# EAGLE design schema (EAGLE 9.3.1)
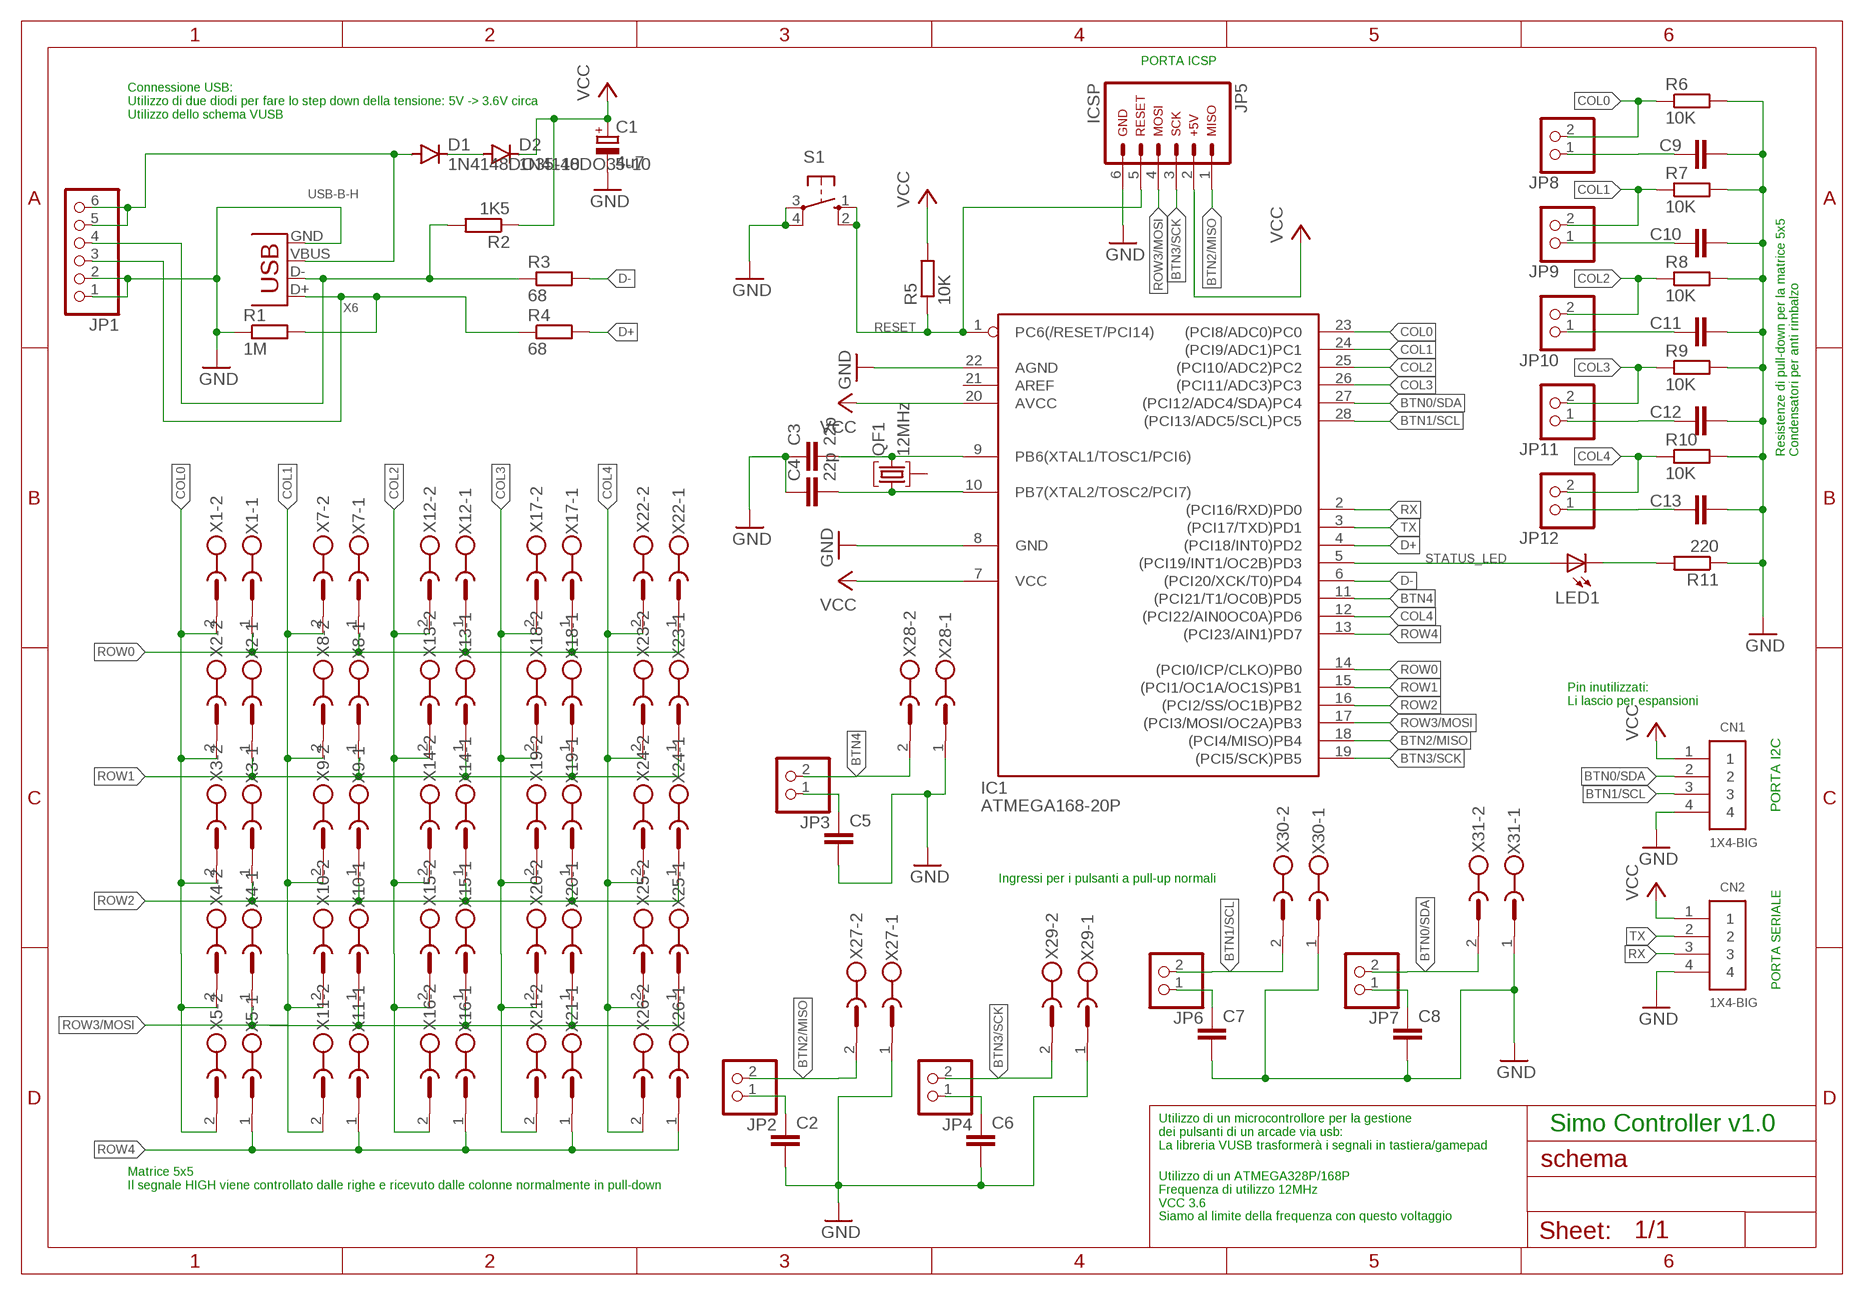
[diagram p0: schematic, sheet 1]

## Parts
C1  4u7  CPOL-EUE5-6  [E5-6]
C2  C-EU050-024X044  [C050-024X044]
C3  22p  C-EU025-030X050  [C025-030X050]
C4  22p  C-EU025-030X050  [C025-030X050]
C5  C-EU050-024X044  [C050-024X044]
C6  C-EU050-024X044  [C050-024X044]
C7  C-EU050-024X044  [C050-024X044]
C8  C-EU050-024X044  [C050-024X044]
C9  C-EU050-024X044  [C050-024X044]
C10  C-EU050-024X044  [C050-024X044]
C11  C-EU050-024X044  [C050-024X044]
C12  C-EU050-024X044  [C050-024X044]
C13  C-EU050-024X044  [C050-024X044]
CN1  1X4-BIG  [1X04-BIG]
CN2  1X4-BIG  [1X04-BIG]
D1  1N4148DO35-10  [DO35-10]
D2  1N4148DO35-10  [DO35-10]
IC1  ATMEGA168-20P  [DIL28-3]
JP1  PINHD-1X6  [1X06]
JP2  PINHD-1X2  [1X02]
JP3  PINHD-1X2  [1X02]
JP4  PINHD-1X2  [1X02]
JP5  ARDUINO_CONN-ICSP  [CONN-2X03]
JP6  PINHD-1X2  [1X02]
JP7  PINHD-1X2  [1X02]
JP8  PINHD-1X2  [1X02]
JP9  PINHD-1X2  [1X02]
JP10  PINHD-1X2  [1X02]
JP11  PINHD-1X2  [1X02]
JP12  PINHD-1X2  [1X02]
LED1  LED3MM  [LED3MM]
QF1  12MHz  10G7A-12.5KHZ  [HC49U]
R1  1M  R-EU_0309/12  [0309/12]
R2  1K5  R-EU_0309/12  [0309/12]
R3  68  R-EU_0309/12  [0309/12]
R4  68  R-EU_0309/12  [0309/12]
R5  10K  R-EU_0309/12  [0309/12]
R6  10K  R-EU_0309/12  [0309/12]
R7  10K  R-EU_0309/12  [0309/12]
R8  10K  R-EU_0309/12  [0309/12]
R9  10K  R-EU_0309/12  [0309/12]
R10  10K  R-EU_0309/12  [0309/12]
R11  220  R-EU_0204/7  [0204/7]
S1  10-XX  [B3F-10XX]
X1  MSTBV2  [MSTBV2]
X2  MSTBV2  [MSTBV2]
X3  MSTBV2  [MSTBV2]
X4  MSTBV2  [MSTBV2]
X5  MSTBV2  [MSTBV2]
X6  USB-B-H  [USB-B-H]
X7  MSTBV2  [MSTBV2]
X8  MSTBV2  [MSTBV2]
X9  MSTBV2  [MSTBV2]
X10  MSTBV2  [MSTBV2]
X11  MSTBV2  [MSTBV2]
X12  MSTBV2  [MSTBV2]
X13  MSTBV2  [MSTBV2]
X14  MSTBV2  [MSTBV2]
X15  MSTBV2  [MSTBV2]
X16  MSTBV2  [MSTBV2]
X17  MSTBV2  [MSTBV2]
X18  MSTBV2  [MSTBV2]
X19  MSTBV2  [MSTBV2]
X20  MSTBV2  [MSTBV2]
X21  MSTBV2  [MSTBV2]
X22  MSTBV2  [MSTBV2]
X23  MSTBV2  [MSTBV2]
X24  MSTBV2  [MSTBV2]
X25  MSTBV2  [MSTBV2]
X26  MSTBV2  [MSTBV2]
X27  MSTBV2  [MSTBV2]
X28  MSTBV2  [MSTBV2]
X29  MSTBV2  [MSTBV2]
X30  MSTBV2  [MSTBV2]
X31  MSTBV2  [MSTBV2]

## Nets
BTN0/SDA: CN1.2 IC1.27((PCI12/ADC4/SDA)PC4) JP7.2 X31.2
BTN1/SCL: CN1.3 IC1.28((PCI13/ADC5/SCL)PC5) JP6.2 X30.2
BTN2/MISO: IC1.18((PCI4/MISO)PB4) JP2.2 JP5.1 X27.2
BTN3/SCK: IC1.19((PCI5/SCK)PB5) JP4.2 JP5.3 X29.2
BTN4: IC1.11((PCI21/T1/OC0B)PD5) JP3.2 X28.2
COL0: IC1.23((PCI8/ADC0)PC0) JP8.2 R6.1 X1.2 X2.2 X3.2 X4.2 X5.2
COL1: IC1.24((PCI9/ADC1)PC1) JP9.2 R7.1 X7.2 X8.2 X9.2 X10.2 X11.2
COL2: IC1.25((PCI10/ADC2)PC2) JP10.2 R8.1 X12.2 X13.2 X14.2 X15.2 X16.2
COL3: IC1.26((PCI11/ADC3)PC3) JP11.2 R9.1 X17.2 X18.2 X19.2 X20.2 X21.2
COL4: IC1.12((PCI22/AIN0OC0A)PD6) JP12.2 R10.1 X22.2 X23.2 X24.2 X25.2 X26.2
D+: IC1.4((PCI18/INT0)PD2) R4.2
D-: IC1.6((PCI20/XCK/T0)PD4) R3.2
GND [power]: C1.- C2.2 C3.1 C4.1 C5.2 C6.2 C7.2 C8.2 C9.2 C10.2 C11.2 C12.2 C13.2 CN1.4 CN2.4 IC1.8(GND) IC1.22(AGND) JP1.1 JP1.2 JP5.6 R1.1 R6.2 R7.2 R8.2 R9.2 R10.2 R11.1 S1.3(P) S1.4(P1) X6.GND X27.1 X28.1 X29.1 X30.1 X31.1
N$1: D1.A JP1.5 JP1.6 X6.VBUS
N$2: D1.C D2.A
N$3: JP1.3 R1.2 R4.1 X6.D+
N$4: JP1.4 R2.2 R3.1 X6.D-
N$5: C3.2 IC1.9(PB6(XTAL1/TOSC1/PCI6)) QF1.3
N$6: C4.2 IC1.10(PB7(XTAL2/TOSC2/PCI7)) QF1.1
N$7: C5.1 JP3.1
N$8: C9.1 JP8.1
N$9: C10.1 JP9.1
N$10: C2.1 JP2.1
N$11: C6.1 JP4.1
N$12: C7.1 JP6.1
N$13: C8.1 JP7.1
N$14: C11.1 JP10.1
N$15: C12.1 JP11.1
N$16: C13.1 JP12.1
N$21: LED1.K(C) R11.2
RESET: IC1.1(PC6(/RESET/PCI14)) JP5.5 R5.1 S1.1(S) S1.2(S1)
ROW0: IC1.14((PCI0/ICP/CLKO)PB0) X1.1 X7.1 X12.1 X17.1 X22.1
ROW1: IC1.15((PCI1/OC1A/OC1S)PB1) X2.1 X8.1 X13.1 X18.1 X23.1
ROW2: IC1.16((PCI2/SS/OC1B)PB2) X3.1 X9.1 X14.1 X19.1 X24.1
ROW3/MOSI: IC1.17((PCI3/MOSI/OC2A)PB3) JP5.4 X4.1 X10.1 X15.1 X20.1 X25.1
ROW4: IC1.13((PCI23/AIN1)PD7) X5.1 X11.1 X16.1 X21.1 X26.1
RX: CN2.3 IC1.2((PCI16/RXD)PD0)
STATUS_LED: IC1.5((PCI19/INT1/OC2B)PD3) LED1.A
TX: CN2.2 IC1.3((PCI17/TXD)PD1)
VCC [power]: C1.+ CN1.1 CN2.1 D2.C IC1.7(VCC) IC1.20(AVCC) JP5.2 R2.1 R5.2
Unconnected: IC1.21(AREF) QF1.2

## Notes on the sheet
- PORTA ICSP
- Connessione USB:
  Utilizzo di due diodi per fare lo step down della tensione: 5V -> 3.6V circa
  Utilizzo dello schema VUSB
- Resistenze di pull-down per la matrice 5x5
  Condensatori per anti rimbalzo
- Pin inutilizzati:
  Li lascio per espansioni
- PORTA I2C
- Ingressi per i pulsanti a pull-up normali
- PORTA SERIALE
- Simo Controller v1.0
- Utilizzo di un microcontrollore per la gestione
  dei pulsanti di un arcade via usb:
  La libreria VUSB trasformerà i segnali in tastiera/gamepad
- Matrice 5x5
  Il segnale HIGH viene controllato dalle righe e ricevuto dalle colonne normalmente in pull-down
- Utilizzo di un ATMEGA328P/168P
  Frequenza di utilizzo 12MHz
  VCC 3.6
  Siamo al limite della frequenza con questo voltaggio

## Library data of the parts
C1 = rcl:CPOL-EU: POLARIZED CAPACITOR, European symbol; SPICEPREFIX: C
C2-C13 = rcl:C-EU: CAPACITOR, European symbol; SPICEPREFIX: C
CN1 CN2 = adafruit:1X4: 4-pin connector
D1 D2 = diode:1N4148: DIODE high speed (Philips)
IC1 = adafruit:ATMEGA168*P: MICROCONTROLLER 16 kBytes FLASH 1 kBytes SRAM 512 Bytes EEPROM USART 8-channel 10 bit ADC
JP1 = pinhead:PINHD-1X6: PIN HEADER
JP2-JP4 JP6-JP12 = pinhead:PINHD-1X2: PIN HEADER
JP5 = arduino_jw:ARDUINO_CONN-ICSP: Arduino ICSP I/O Header This is the ICSP I/O header on the Arduino Uno R3. This connector is labeled with the following pin assignments: MISO +5V SCK MOSI RESET GND NOTE: Be sure you install this connector with the correct orientation on your PCB layout. Pin 1 has a square pad to assist with orientation.
LED1 = adafruit:LED: LED OSRAM: - CHIPLED LG R971, LG N971, LY N971, LG Q971, LY Q971, LO R971, LY R971 LH N974, LH R974 LS Q976, LO Q976, LY Q976 LO Q996 - Hyper CHIPLED LW Q18S LB Q993, LB Q99A, LB R99A - SideLED LS A670, LO A670, LY A670, LG A670, LP A670 LB A673, LV A673, LT A673, LW A673 LH A674 LY A675 LS A676, LA A676, LO A676, LY A676, LW A676 LS A679, LY A679, LG A679 - Hyper Micro SIDELED® LS Y876, LA Y876, LO Y876, LY Y876 LT Y87S - SmartLED LW L88C, LW L88S LB L89C, LB L89S, LG L890 LS L89K, LO L89K, LY L89K LS L896, LA L896, LO L896, LY L896 - TOPLED LS T670, LO T670, LY T670, LG T670, LP T670 LSG T670, LSP T670, LSY T670, LOP T670, LYG T670 LG T671, LOG T671, LSG T671 LB T673, LV T673, LT T673, LW T673 LH T674 LS T676, LA T676, LO T676, LY T676, LB T676, LH T676, LSB T676, LW T676 LB T67C, LV T67C, LT T67C, LS T67K, LO T67K, LY T67K, LW E67C LS E67B, LA E67B, LO E67B, LY E67B, LB E67C, LV E67C, LT E67C LW T67C LS T679, LY T679, LG T679 LS T770, LO T770, LY T770, LG T770, LP T770 LB T773, LV T773, LT T773, LW T773 LH T774 LS E675, LA E675, LY E675, LS T675 LS T776, LA T776, LO T776, LY T776, LB T776 LHGB T686 LT T68C, LB T68C - Hyper Mini TOPLED® LB M676 - Mini TOPLED Santana® LG M470 LS M47K, LO M47K, LY M47K Source: http://www.osram.convergy.de/
QF1 = crystal:10G: Monolithic Crystal Filters Source: www.golledge.com; OC_FARNELL: unknown; OC_NEWARK: unknown
R1-R11 = rcl:R-EU_: RESISTOR, European symbol; SPICEPREFIX: R
S1 = switch-omron:10-XX: OMRON SWITCH; MPN: B3F-1000; OC_FARNELL: 176432; OC_NEWARK: 36M3542
X1-X5 X7-X31 = con-phoenix-500:MSTBV2: PHOENIX; OC_FARNELL: unknown; OC_NEWARK: unknown
X6 = con-usb:USB: USB Connectors

## Net classes
0 default: width 0.4 mm
1 power: width 0.8 mm

## Board
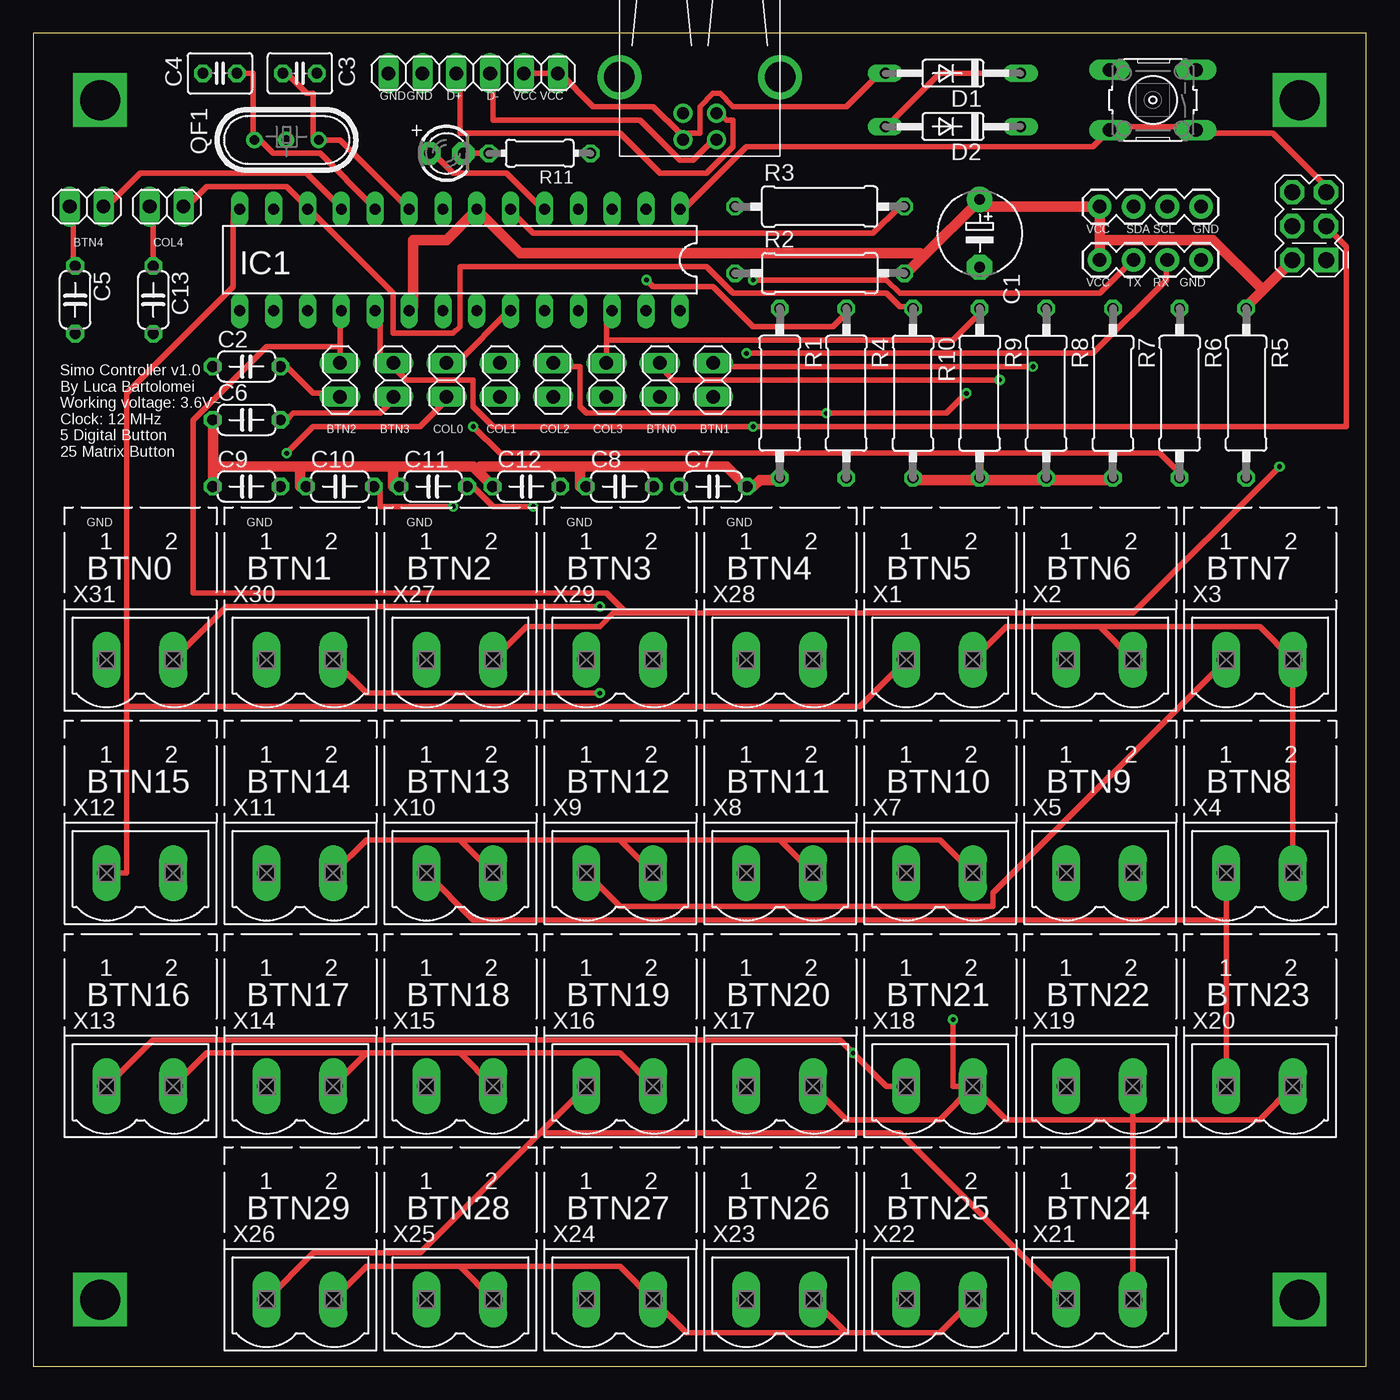
[diagram p1: board, top side]
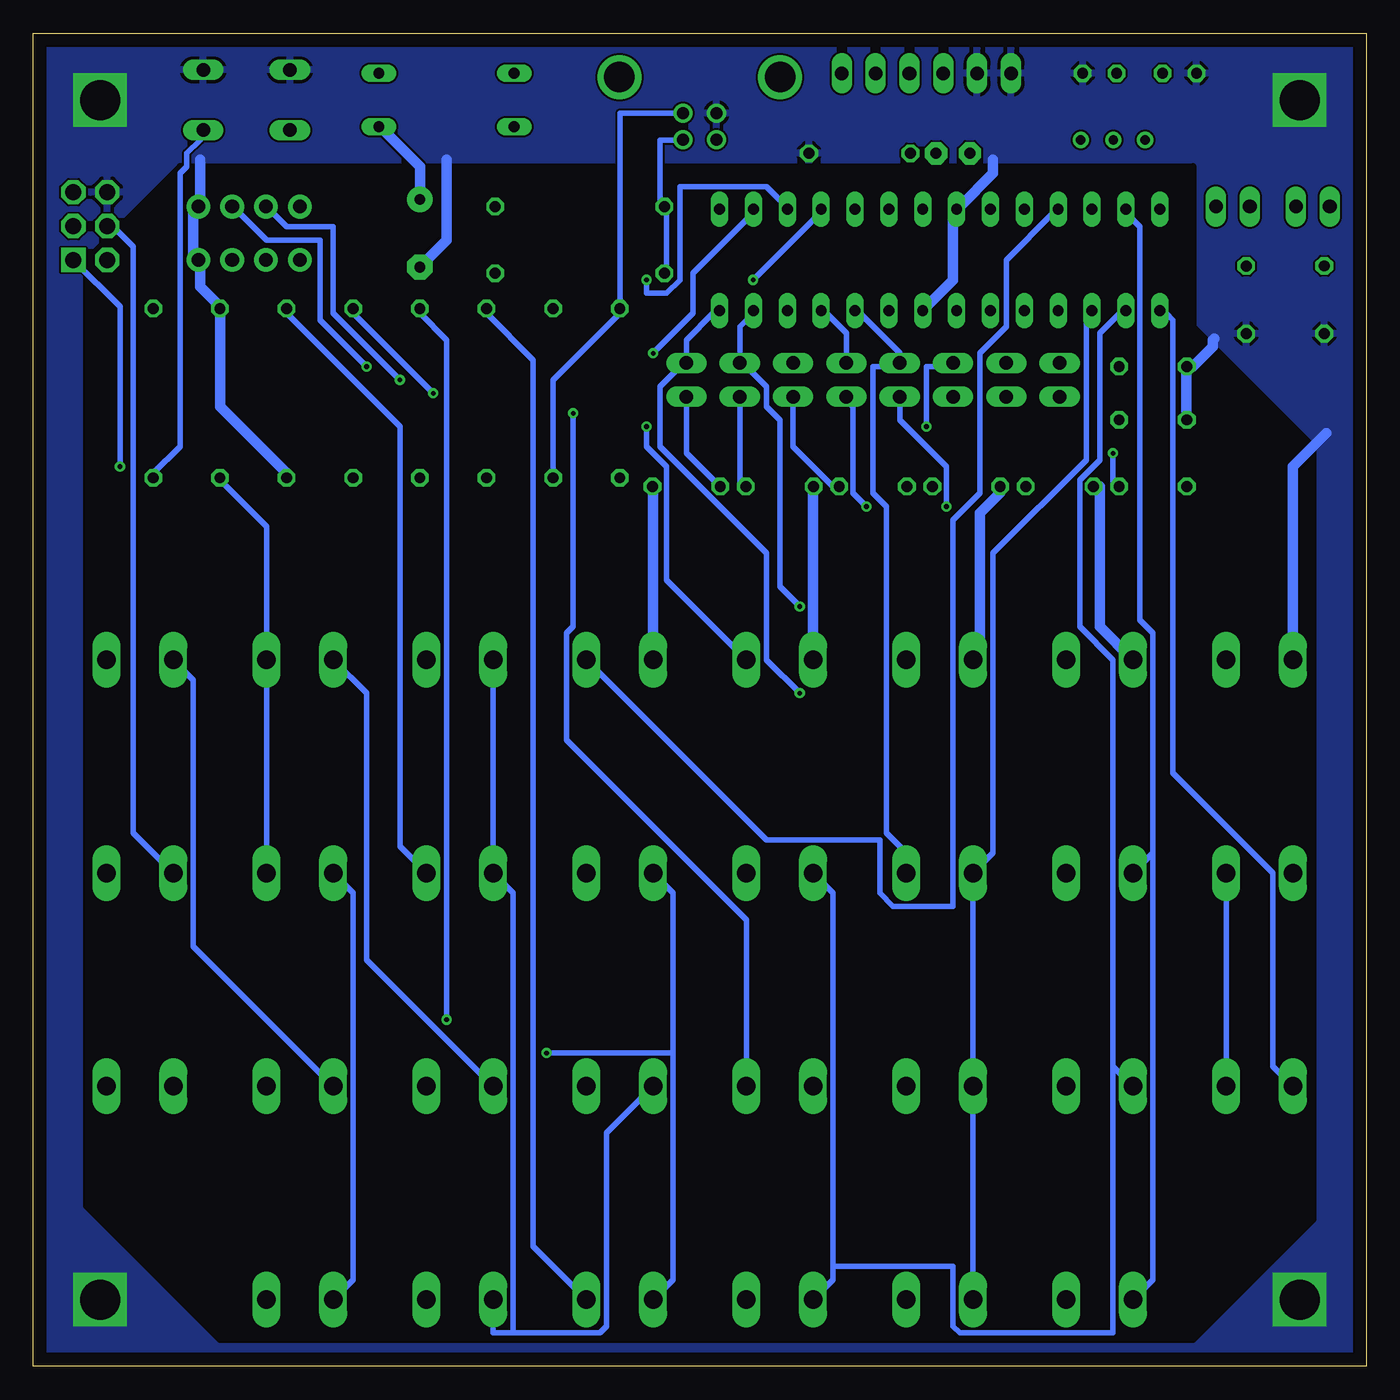
[diagram p2: board, bottom side, seen from below]

Size 100 x 100 mm. Coordinates in mm from the lower left corner, seen from the top.
Outline: 0,0 100,0 100,100 0,100 0,0
Copper layers (1*16): Top 0.035mm / dielectric 1.5mm / Bottom 0.035mm
Design rules "default": minimum track width 6mil, minimum drill 0.35mm, track to track 6mil, track to pad 6mil, pad to pad 6mil, via to via 6mil, smd to smd 6mil, copper to edge 40mil, drill to drill 6mil, minimum pad ring 10mil, minimum via ring 8mil, stop-mask expansion 4mil, vias tented up to drill 0mil, thermal gap 10mil

### Footprints (pad centres in the part's own frame; a part is rotated, then mirrored left to right if it is on the bottom)
E5-6 = drill 0.813 pad 1.905: + -2.54,0 | drill 0.813 pad 1.905 octagon: - 2.54,0
C050-024X044 = drill 0.813 octagon: 1 -2.54,0; 2 2.54,0
C025-030X050 = drill 0.813 octagon: 1 -1.27,0; 2 1.27,0
1X04-BIG = drill 1.016 pad 1.778: 1 0,0; 2 2.54,0; 3 5.08,0; 4 7.62,0
DO35-10 = drill 0.813 long: A 5.08,0; C -5.08,0
DIL28-3 = drill 0.813 long: 1 -16.51,-3.81; 2 -13.97,-3.81; 3 -11.43,-3.81; 4 -8.89,-3.81; 5 -6.35,-3.81; 6 -3.81,-3.81; 7 -1.27,-3.81; 8 1.27,-3.81; 9 3.81,-3.81; 10 6.35,-3.81; 11 8.89,-3.81; 12 11.43,-3.81; 13 13.97,-3.81; 14 16.51,-3.81; 15 16.51,3.81; 16 13.97,3.81; 17 11.43,3.81; 18 8.89,3.81; 19 6.35,3.81; 20 3.81,3.81; 21 1.27,3.81; 22 -1.27,3.81; 23 -3.81,3.81; 24 -6.35,3.81; 25 -8.89,3.81; 26 -11.43,3.81; 27 -13.97,3.81; 28 -16.51,3.81
1X06 = drill 1.016 long: 1 -6.35,0; 2 -3.81,0; 3 -1.27,0; 4 1.27,0; 5 3.81,0; 6 6.35,0
1X02 = drill 1.016 long: 1 -1.27,0; 2 1.27,0
CONN-2X03 = drill 1.2 pad 1.829 square: 1 0,0 | drill 1.2 pad 1.829 octagon: 2 2.54,0; 3 0,-2.54; 4 2.54,-2.54; 5 0,-5.08; 6 2.54,-5.08
LED3MM = drill 0.813 pad 1.676 octagon: A -1.27,0; K 1.27,0
HC49U = drill 0.7 pad 1.2: 1 -2.413,0; 2 -0.027,0; 3 2.413,0
0309/12 = drill 0.813 octagon: 1 -6.35,0; 2 6.35,0
0204/7 = drill 0.813 octagon: 1 -3.81,0; 2 3.81,0
B3F-10XX = drill 1.016 long: 1 -3.251,2.261; 2 3.251,2.261; 3 -3.251,-2.261; 4 3.251,-2.261
MSTBV2 = drill 1.397 long: 1 -2.5,0; 2 2.5,0
USB-B-H = drill 0.914: D+ 0,1.25; D- 1.981,1.25; GND 0,-1.25; VBUS 1.981,-1.25 | drill 2.286: P$1 -2.718,-6.02; P$2 -2.718,6.02

### Placement (x,y rotation side)
C1  71,85 270 top
C2  16,75 180 top
C3  20,97 180 top
C4  14,97 0 top
C5  3.14,80.01 270 top
C6  16,71 180 top
C7  51,66 0 top
C8  44,66 180 top
C9  16,66 180 top
C10  23,66 180 top
C11  30,66 180 top
C12  37,66 180 top
C13  9,80 270 top
CN1  80,87 0 top
CN2  80,83 0 top
D1  69,97 180 top
D2  69,93 180 top
IC1  32,83 180 top
JP1  33,97 0 top
JP2  23,74 90 top
JP3  4,87 0 top
JP4  27,74 90 top
JP5  97,83 180 top
JP6  51,74 90 top
JP7  47,74 90 top
JP8  31,74 90 top
JP9  35,74 90 top
JP10  39,74 90 top
JP11  43,74 90 top
JP12  10,87 0 top
LED1  31,91 0 top
QF1  19,92 0 top
R1  56,73 90 top
R2  59,82 180 top
R3  59,87 0 top
R4  61,73 90 top
R5  91,73 90 top
R6  86,73 90 top
R7  81,73 270 top
R8  76,73 270 top
R9  71,73 270 top
R10  66,73 270 top
R11  38,91 180 top
S1  84,95 180 top
X1  68,53 0 top
X2  80,53 0 top
X3  92,53 0 top
X4  92,37 0 top
X5  80,37 0 top
X6  50,94 270 top
X7  68,37 0 top
X8  56,37 0 top
X9  44,37 0 top
X10  32,37 0 top
X11  20,37 0 top
X12  8,37 0 top
X13  8,21 0 top
X14  20,21 0 top
X15  32,21 0 top
X16  44,21 0 top
X17  56,21 0 top
X18  68,21 0 top
X19  80,21 0 top
X20  92,21 0 top
X21  80,5 0 top
X22  68,5 0 top
X23  56,5 0 top
X24  44,5 0 top
X25  32,5 0 top
X26  20,5 0 top
X27  32,53 0 top
X28  56,53 0 top
X29  44,53 0 top
X30  20,53 0 top
X31  8,53 0 top

### Tracks (layer width: path | path; a pad name or v marks a point on that pad's centre or on a via)
BTN0/SDA  (via drill 0.35)
  Top 0.4: v72.5,74 48,74 47,75 JP7.2 | X31.2 14.5,57 v42.5,57
  Bottom 0.4: 47,75.5 47,78 46,79 IC1.27 | 47,75.5 JP7.2 47,75.5 | v72.5,74 77.5,79 77.5,85.5 81,85.5 82.5,87 CN1.2 | v42.5,57 44,58.5 44,71 45,72 45,73.5 47,75.5
BTN1/SCL  (via drill 0.35)
  Top 0.4: v75,75 51,75 JP6.2 | X30.2 25,50.5 v42.5,50.5
  Bottom 0.4: 51,75.5 51,77 49,79 IC1.28 | 51,75.5 JP6.2 51,75.5 | v75,75 78.5,78.5 78.5,84.5 82.5,84.5 85,87 CN1.3 | v42.5,50.5 45,53 45,61 53,69 53,73.5 51,75.5
BTN2/MISO  (via drill 0.35)
  Top 0.4: 23,76.5 23,75.5 JP2.2 | 23,76.5 23,79 IC1.18 | v93.5,67.5 82.5,56.5 44.5,56.5 | 44.5,56.5 43.5,56.5 42.5,55.5 37,55.5 X27.2 | 23,76.5 17.5,76.5 12,71 12,58 43,58 44.5,56.5
  Bottom 0.4: JP5.1 93.5,79.5 v93.5,67.5
BTN3/SCK  (via drill 0.35)
  Top 0.4: IC1.19 26,79 26,75.5 27,75.5 JP4.2 27,75 28,74 33,74 33,72 34.5,70.5 v54,70.5 98.5,70.5 98.5,84 97,85.5 JP5.3
  Bottom 0.4: X29.2 52.5,59 52.5,67.5 54,69 v54,70.5
BTN4
  Top 0.4: IC1.11 23,87 20.5,89.5 8,89.5 5.5,87 JP3.2
  Bottom 0.4: X28.2 45,39.5 36.5,39.5 36.5,35.5 35.5,34.5 31,34.5 31,63.5 29,65.5 29,76 27,78 27,83 23.5,86.5 IC1.11
COL0  (via drill 0.35)
  Top 0.4: X4.2 X3.2 92,55.5 80,55.5 | IC1.23 35.5,79 32,75.5 31,75.5 JP8.2 | X1.2 73,55.5 80,55.5 | X2.2 80,55.5 | v33,70.5 35,68.5 84.5,68.5 86,67 R6.1
  Bottom 0.4: R6.1 86,66.5 82.5,63 X2.2 X5.2 | v33,70.5 33,75 31,75 JP8.2
COL1
  Top 0.4: X11.2 25,39.5 32,39.5 | X10.2 32,39.5 | 44,39.5 X9.2 | 32,39.5 44,39.5 | 56,39.5 X8.2 | 44,39.5 56,39.5 | X7.2 68,39.5 56,39.5
  Bottom 0.4: X7.2 72.5,39 72.5,70.5 81,79 R7.1 | IC1.24 38,79 35,76 35,75.5 JP9.2 35,75 37,75 37,65.5 36,64.5 36,40 34.5,38.5 X10.2
COL2  (via drill 0.35)
  Top 0.4: v70,73 68.5,71.5 v59.5,71.5 41.5,71.5 41,72 41,75 39,75 JP10.2 | 25,23.5 X14.2 | 32,23.5 25,23.5 | X15.2 32,23.5 | X16.2 44,23.5 32,23.5 | X13.2 13,23.5 25,23.5
  Bottom 0.4: IC1.25 40.5,79 39,77.5 39,75.5 JP10.2 | v70,73 76,79 R8.1 | X12.2 X13.2 | v59.5,71.5 59.5,55.5 60,55 60,47 46.5,33.5 X16.2
COL3  (via drill 0.35)
  Top 0.4: 43,77 43,75.5 JP11.2 | 43,77 43,79 IC1.26 | 43,77 69,77 71,79 R9.1 | X17.2 61,18.5 68,18.5 X18.2 | X19.2 82.5,18.5 | 82.5,18.5 X21.2 | X20.2 92,18.5 82.5,18.5 | X18.2 73,18.5 82.5,18.5 | v69,26 69,21 X18.2
  Bottom 0.4: v69,26 69,77 71,79 R9.1
COL4
  Top 0.4: X26.2 25,7.5 32,7.5 | X25.2 32,7.5 | 32,7.5 44,7.5 X24.2 49,2.5 61,2.5 | JP12.2 11.5,87 13,88.5 19,88.5 20.5,87 IC1.12 21,86.5 27,80.5 27,77.5 31.5,77.5 32,78 32,82.5 50.5,82.5 52.5,80.5 64,80.5 65,79.5 66,79.5 R10.1 | X22.2 68,2.5 61,2.5 | X23.2 61,2.5
  Bottom 0.4: X23.2 62.5,9 62.5,75.5 66,79 R10.1
D+  (via drill 0.35)
  Top 0.4: v46,81.5 46.5,81 51,81 54,78 60,78 61,79 R4.2
  Bottom 0.4: v46,81.5 41,86.5 IC1.4
D-
  Top 0.4: IC1.6 36,86.5 37.5,85 63,85 65,87 R3.2
GND  (via drill 3)
  Top 0.8: R1.1 56,66.5 54.5,66.5 54,66 C7.2 53.5,66 52,67.5 41,67.5 | 13.5,67.5 13.5,71 C6.2 | 13.5,67.5 13.5,66 C9.2 | 20,67.5 20,66 C10.2 | 13.5,67.5 20,67.5 | 27,67.5 27,66 C11.2 | 20,67.5 27,67.5 | 33.25,67.25 33,67.5 27,67.5 | 33.25,67.25 34.5,66 C12.2 | 41,67.5 41,66 C8.2 | 41,67.5 33.5,67.5 33.25,67.25 | 71,66.5 66,66.5 R10.2 | 71,66.5 R9.2 71,66.5 | 71,66.5 76,66.5 | 76,66.5 R8.2 76,66.5 | 76,66.5 81,66.5 R7.2
  Bottom 0.8: X28.1 53.5,66 C7.2 | X30.1 20,55.5 20,66 C10.2 | X27.1 29,53.5 29,64 27.5,65.5 27.5,66 C11.2 | X29.1 41.5,66 C8.2 | 11.39,77.11 11.5,77 11.5,76.5 13,75 C2.2 13.5,75 13.5,71 C6.2 | 28,90.51 28,90.5 28,89.5 30.5,87 IC1.8 31,86.5 31,81.5 33,79.5 IC1.22 | 87.5,90.51 87.5,90.5 87.5,87 CN1.4 88,87 88,83 CN2.4 87.5,83 87.5,81 86,79.5 R6.2 86,79 86,72 81,67 R7.2 | C1.- 71,82.5 69,84.5 69,90.5 69,90.51 | X31.1 5.5,67.5 3,70
  other vias: 5,95 95,95 5,5 95,5
  pour Bottom: 0,100 100,100 100,0 0,0
  cutout Bottom: 13,90 13,78 4,69 4,11 13,2 86,2 96,12 96,83 89,90
N$1
  Top 0.4: JP1.5 37,97 39,97 JP1.6 39.5,97 42,94.5 46.5,94.5 48.5,92.5 X6.VBUS 49,92.5 50,92.5 50,94.5 51,95.5 51.5,95.5 52.5,94.5 61,94.5 63.5,97 D1.A
N$2
  Top 0.4: D2.A 64,93 68,97 74,97 D1.C
N$3
  Top 0.4: JP1.3 32,97 32,92.5 44,92.5 47,89.5 50.5,89.5 52.5,91.5 52.5,93.5 52,93.5 51.5,94 X6.D+
  Bottom 0.4: R4.1 61,67 61,74 56,79 R1.2 56,79.5 56,94 51.5,94 X6.D+
N$4
  Top 0.4: JP1.4 34.5,97 34.5,93.5 45.5,93.5 48.5,90.5 49.5,90.5 51,92 X6.D-
  Bottom 0.4: R2.2 52.5,82 52.5,87 R3.1 53,87 53,92 51.5,92 X6.D-
N$5
  Top 0.4: C3.2 19,97 20.5,95.5 21,95.5 21,92 QF1.3 21.5,92 23,92 28,87 IC1.9
N$6
  Top 0.4: C4.2 15.5,97 16.5,97 16.5,92 QF1.1 17,92 18,91 21.5,91 25.5,87 IC1.10
N$7
  Top 0.4: C5.1 3,83 3,87 JP3.1
N$8  (via drill 0.35)
  Top 0.4: v19,68.5 21,70.5 29,70.5 31,72.5 JP8.1
  Bottom 0.4: v19,68.5 19,66 C9.1
N$9  (via drill 0.35)
  Top 0.4: v31.5,64.5 26,64.5 26,66 C10.1
  Bottom 0.4: v31.5,64.5 31.5,67.5 35,71 35,72.5 JP9.1
N$10
  Top 0.4: C2.1 19,75 21,73 23,73 JP2.1
N$11
  Top 0.4: C6.1 19,71 19.5,71.5 26,71.5 27,72.5 JP4.1
N$12
  Bottom 0.4: C7.1 48.5,66 51,68.5 51,72.5 JP6.1
N$13
  Bottom 0.4: C8.1 47,66 47,72.5 JP7.1
N$14  (via drill 0.35)
  Top 0.4: v37.5,64.5 34.5,64.5 33,66 C11.1
  Bottom 0.4: v37.5,64.5 38.5,65.5 38.5,72 39,72.5 JP10.1
N$15
  Bottom 0.4: C12.1 40,66 43,69 43,72.5 JP11.1
N$16
  Top 0.4: C13.1 9,83 9,87 JP12.1
N$21
  Top 0.4: R11.2 34,91 32.5,91 LED1.K
RESET
  Top 0.4: JP5.5 97,88.5 93,92.5 87.5,92.5 S1.1 87,93 81,93 S1.2 80.5,92.5 79.5,91.5 53.5,91.5 49,87 IC1.1
  Bottom 0.4: R5.1 91,67 89,69 89,89.5 88.5,90 88.5,91 87.5,92 87.5,92.5 S1.1
ROW0
  Top 0.4: 7,49.5 7,37 X12.1 | 7,49.5 7,67 | 7,67 7,73 15,81 15,86.5 IC1.14 | 7,49.5 62,49.5 X1.1 | 7,67
  Bottom 0.4: X1.1 X7.1 64,35.5 64,2.5 | X17.1 57,17.5 57,3 57.5,2.5 64,2.5 | 64,2.5 65.5,2.5 X22.1
ROW1  (via drill 0.35)
  Top 0.4: X18.1 64,21 v61.5,23.5 60.5,24.5 9,24.5 X13.1
  Bottom 0.4: X13.1 7,22.5 7,37 14.5,44.5 14.5,78.5 15,79 IC1.15 | X23.1 52,6.5 52,23.5 | 52,23.5 52,35.5 X8.1 | X18.1 75,30.5 75,50.5 X2.1 | v61.5,23.5 52,23.5
ROW2
  Top 0.4: X3.1 72,35.5 72,34.5 44,34.5 X9.1
  Bottom 0.4: X19.1 88,31.5 88,51.5 X3.1 | X24.1 40,6.5 40,7.5 | 40,7.5 40,35.5 X9.1 | 19,22.5 19,53 21.5,55.5 21.5,66.5 20,68 20,77.5 18.5,79 IC1.16 | X14.1 19,22.5 | 40,7.5 31,7.5 31,3 30.5,2.5 19,2.5 19,22.5
ROW3/MOSI
  Top 0.4: X4.1 89.5,33.5 | 89.5,33.5 X20.1 | 89.5,33.5 33,33.5 X10.1
  Bottom 0.4: X4.1 92.5,40 92.5,84 94,85.5 JP5.4 | X25.1 X15.1 X10.1 28,38.5 28,61 21,68 21,79 IC1.17
ROW4
  Top 0.4: 38,17.5 29,8.5 21,8.5 X26.1 | 38,17.5 X16.1 | X21.1 65,17.5 38,17.5
  Bottom 0.4: X21.1 76,6.5 76,35.5 X5.1 | 16,38.5 16,55 17,56 17,85.5 18,86.5 IC1.13 | X11.1 16,38.5 | X26.1 16,6.5 16,38.5
RX  (via drill 0.35)
  Top 0.4: v53.5,76 79.5,76 85,81.5 85,83 CN2.3
  Bottom 0.4: v53.5,76 50.5,79 50.5,82 46,86.5 IC1.2
STATUS_LED
  Top 0.4: IC1.5 38,87 35.5,89.5 31.5,89.5 30,91 LED1.A
TX  (via drill 0.35)
  Top 0.4: v54,81.5 64,81.5 65,80.5 80,80.5 82.5,83 CN2.2
  Bottom 0.4: v54,81.5 54,80.5 52.5,80.5 51.5,81.5 51.5,88.5 45,88.5 43.5,87 IC1.3
VCC
  Top 0.8: IC1.20 28.5,79.5 28.5,84.5 31,84.5 33,86.5 IC1.7 33.5,86.5 36.5,83.5 66.5,83.5 66.75,83.25 | 92.25,80.75 94.5,83 JP5.2 | 92.25,80.75 91,79.5 R5.2 | 80,84.5 CN1.1 71,87 C1.+ 71,87.5 66.75,83.25 | 80,84.5 CN2.1 | 66.75,83.25 65.5,82 R2.1 | 80,84.5 88.5,84.5 92,81 92.25,80.75
  Bottom 0.8: D2.C 74,93 71,90 71,88 C1.+

### Text on the board
tNames: GND | GND | D+ | D- | VCC | VCC | VCC | SDA | SCL | GND | BTN4 | COL4 | VCC | TX | RX | GND | BTN2 | BTN3 | COL0 | COL1 | COL2 | COL3 | BTN0 | BTN1 | Simo Controller v1.0 / By Luca Bartolomei / Working voltage: 3.6V~ / Clock: 12 MHz / 5 Digital Button / 25 Matrix Button | GND | GND | GND | GND | GND | BTN0 | BTN1 | BTN2 | BTN3 | BTN4 | BTN5 | BTN6 | BTN7 | BTN15 | BTN14 | BTN13 | BTN12 | BTN11 | BTN10 | BTN9 | BTN8 | BTN16 | BTN17 | BTN18 | BTN19 | BTN20 | BTN21 | BTN22 | BTN23 | BTN29 | BTN28 | BTN27 | BTN26 | BTN25 | BTN24